# EasyEDA schematic 1-Schematic_EMWAVER_DIY_V2.json
TITLE: Sheet_1; REV: 1.0; Date: 2025-06-19; Sheet: 1/1; Drawn By: maarnotto; Company: Your Company
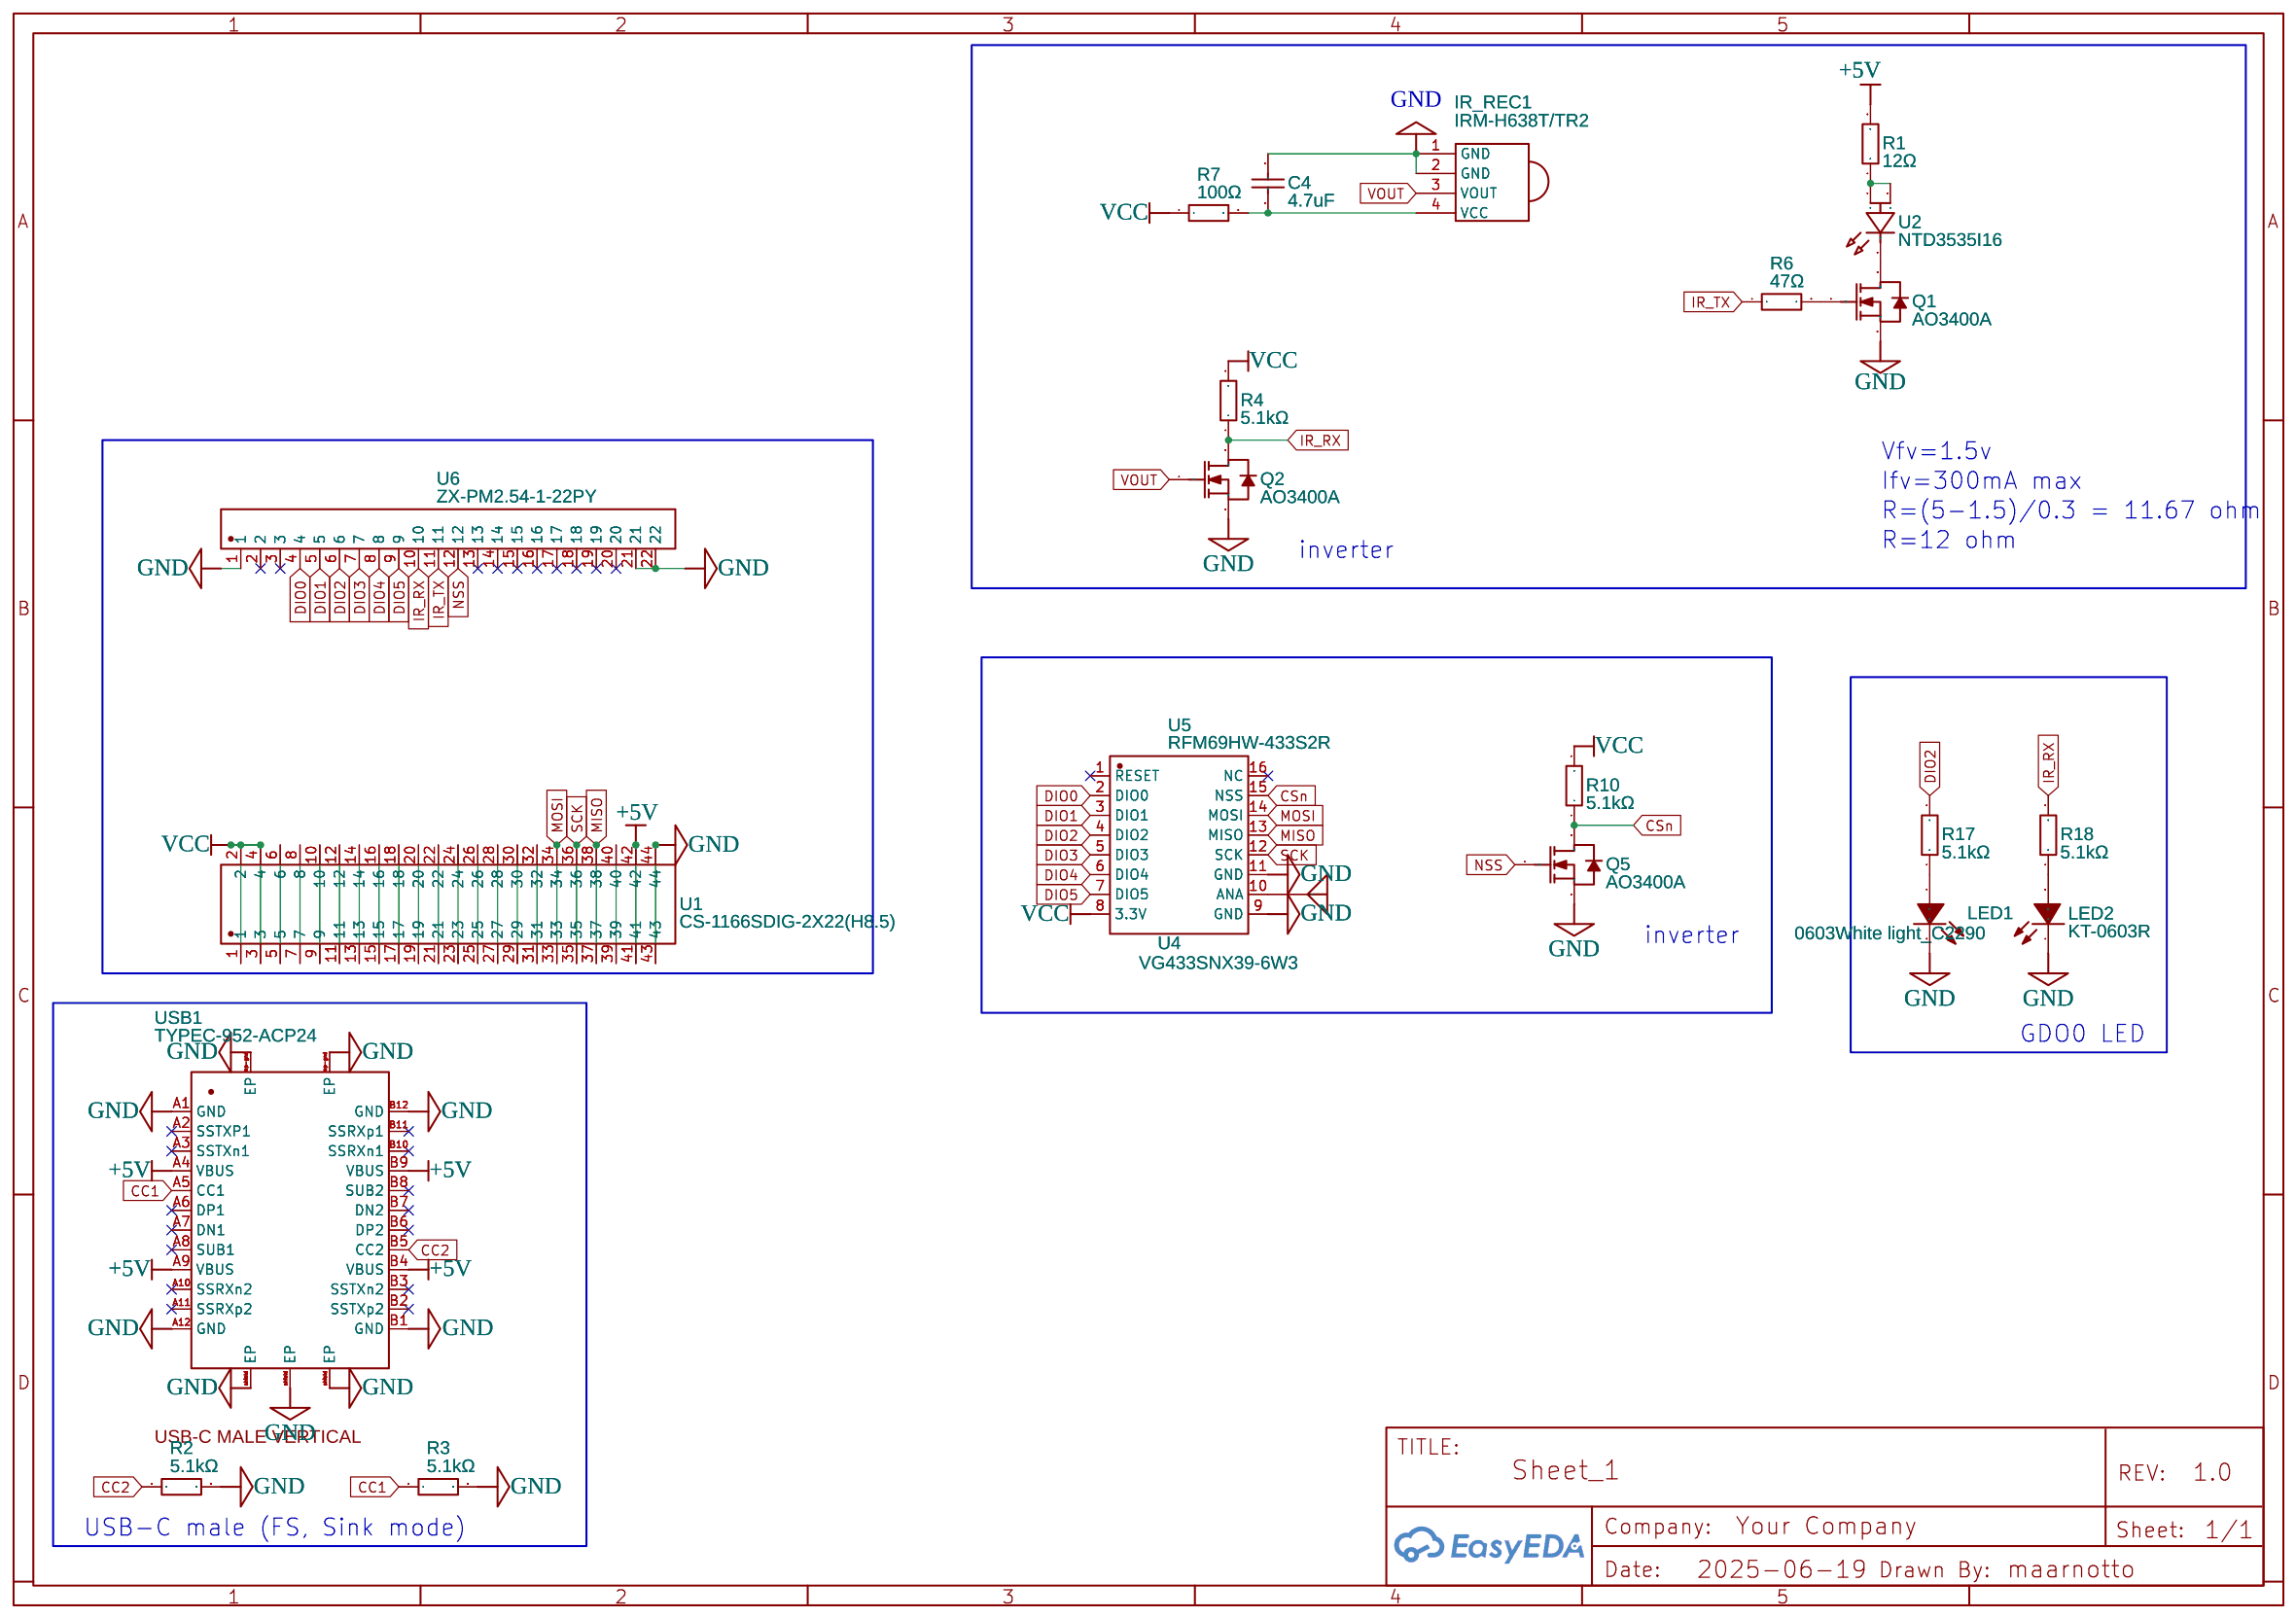
[diagram p0: schematic sheet]

## Parts
C4  4.7uF  [C0603]
IR_REC1  IRM-H638T/TR2  [SENSOR-SMD_IRM-H638T-TR2-TL]
LED1  0603White light_C2290  [LED0603-R-RD_WHITE]
LED2  KT-0603R  [LED0603-RD]
Q1  AO3400A  [SOT-23-3_L2.9-W1.6-P1.90-LS2.8-BR]
Q2  AO3400A  [SOT-23-3_L2.9-W1.6-P1.90-LS2.8-BR]
Q5  AO3400A  [SOT-23-3_L2.9-W1.6-P1.90-LS2.8-BR]
R1  12Ω  [R2512]
R2  5.1kΩ  [R0603]
R3  5.1kΩ  [R0603]
R4  5.1kΩ  [R0603]
R6  47Ω  [R0805]
R7  100Ω  [R0805]
R10  5.1kΩ  [R0603]
R17  5.1kΩ  [R0603]
R18  5.1kΩ  [R0603]
U1  CS-1166SDIG-2X22(H8.5)  [HDR-TH_44P-2.54-V-F-R2-C22-S2.54]
U2  NTD3535I16  [LED-SMD_3P-L3.5-W3.5-NTD3535I16]
U4  VG433SNX39-6W3  [ANT-TH_T14-433M]
U5  RFM69HW-433S2R  [WIRELM-SMD_RFM69HW-433S2R]
U6  ZX-PM2.54-1-22PY  [HDR-TH_22P-P2.54-V-F]
USB1  TYPEC-952-ACP24  [USB-C MALE VERTICAL]

## Library data of the parts
C4 = CL10A475KO8NNNC: Supplier: LCSC; Manufacturer: SAMSUNG(三星); Supplier Part: C19666; JLCPCB Part Class: Basic Part
IR_REC1 = IRM-H638T/TR2: Supplier: LCSC; Manufacturer: EVERLIGHT(亿光); Supplier Part: C91447; JLCPCB Part Class: Extended Part
LED1 = 0603White light_C2290: Supplier: LCSC; Manufacturer: KENTO; Manufacturer Part: KT-0603W; Supplier Part: C2290; JLCPCB Part Class: Basic Part
LED2 = KT-0603R: Supplier: LCSC; Manufacturer: KENTO; Supplier Part: C2286; JLCPCB Part Class: Basic Part
Q1 Q2 Q5 = AO3400A: Supplier: LCSC; Manufacturer: AOS; Supplier Part: C20917; JLCPCB Part Class: Basic Part
R1 = 25121WJ0120T4E: Supplier: LCSC; Manufacturer: UNI-ROYAL(厚声); Supplier Part: C32443; JLCPCB Part Class: Extended Part
R2-R4 R10 R17 R18 = 0603WAF5101T5E: Supplier: LCSC; Manufacturer: UNI-ROYAL(厚声); Supplier Part: C23186; JLCPCB Part Class: Basic Part
R6 = 0805W8F470JT5E: Supplier: LCSC; Manufacturer: UNI-ROYAL(厚声); Supplier Part: C17714; JLCPCB Part Class: Basic Part
R7 = 0805W8F1000T5E: Supplier: LCSC; Manufacturer: UNI-ROYAL(厚声); Supplier Part: C17408; JLCPCB Part Class: Basic Part
U1 = CS-1166SDIG-2X22(H8.5): Contributor: lcsc; Supplier: LCSC; Supplier Part: C2986996; Manufacturer: CST(永丰盈); JLCPCB Part Class: Extended Part
U2 = NTD3535I16: Supplier: LCSC; Supplier Part: C7464756; Manufacturer: 国星光电; Contributor: lcsc; JLCPCB Part Class: Extended Part
U4 = VG433SNX39-6W3: Contributor: lcsc; Supplier: LCSC; Supplier Part: C718844; Manufacturer: Vollgo(沃进); JLCPCB Part Class: Extended Part
U5 = RFM69HW-433S2R: Supplier: LCSC; Supplier Part: C22395813; Manufacturer: null; Contributor: lcsc; JLCPCB Part Class: Extended Part
U6 = ZX-PM2.54-1-22PY: Supplier: LCSC; Supplier Part: C7499337; Manufacturer: Megastar(兆星); Contributor: lcsc; JLCPCB Part Class: Extended Part
USB1 = TYPEC-952-ACP24: Contributor: LCSC; Supplier: LCSC; Supplier Part: C2840398; Manufacturer: XUNPU(讯普); JLCPCB Part Class: Extended Part; Package Display: Yes

## Nets
+5V: R1.2 U1.41 U1.42 USB1.A4(VBUS) USB1.A9(VBUS) USB1.B4(VBUS) USB1.B9(VBUS)
GND: C4.2 IR_REC1.1(GND) IR_REC1.2(GND) LED1.2(K) LED2.1(K) Q1.2(S) Q2.2(S) Q5.2(S) R2.2 R3.2 U1.43 U1.44 U5.9(GND) U5.11(GND) U6.1 U6.21 U6.22 USB1.A1(GND) USB1.A12(GND) USB1.B1(GND) USB1.B12(GND) USB1.mp-gnd(EP) USB1.shield(EP)
VCC: R4.2 R7.1 R10.2 U1.1 U1.2 U1.3 U1.4 U5.8(3.3V)
CC1: R3.1 USB1.A5(CC1)
CC2: R2.1 USB1.B5(CC2)
CSn: Q5.3(D) R10.1 U5.15(NSS)
DIO0: U5.2(DIO0) U6.4
DIO1: U5.3(DIO1) U6.5
DIO2: R17.2 U5.4(DIO2) U6.6
DIO3: U5.5(DIO3) U6.7
DIO4: U5.6(DIO4) U6.8
DIO5: U5.7(DIO5) U6.9
IR_RX: Q2.3(D) R4.1 R18.2 U6.10
IR_TX: R6.1 U6.11
MISO: U1.37 U1.38 U5.13(MISO)
MOSI: U1.33 U1.34 U5.14(MOSI)
NSS: Q5.1(G) U6.12
SCK: U1.35 U1.36 U5.12(SCK)
VOUT: IR_REC1.3(VOUT) Q2.1(G)
Net-(C4-1): C4.1 IR_REC1.4(VCC) R7.2
Net-(LED1-1): LED1.1(A) R17.1
Net-(LED2-2): LED2.2(A) R18.1
Net-(Q1-1): Q1.1(G) R6.2
Net-(Q1-3): Q1.3(D) U2.3(K)
Net-(R1-1): R1.1 U2.1(A) U2.2
Net-(U1-5): U1.5 U1.6
Net-(U1-7): U1.7 U1.8
Net-(U1-9): U1.9 U1.10
Net-(U1-11): U1.11 U1.12
Net-(U1-13): U1.13 U1.14
Net-(U1-15): U1.15 U1.16
Net-(U1-17): U1.17 U1.18
Net-(U1-19): U1.19 U1.20
Net-(U1-21): U1.21 U1.22
Net-(U1-23): U1.23 U1.24
Net-(U1-25): U1.25 U1.26
Net-(U1-27): U1.27 U1.28
Net-(U1-29): U1.29 U1.30
Net-(U1-31): U1.31 U1.32
Net-(U1-39): U1.39 U1.40
Net-(U4-1): U4.1 U5.10(ANA)

Not connected (* = marked no-connect by the designer): U5 1(RESET)* 16(NC)*; U6 2* 3* 13* 14* 15* 16* 17* 18* 19* 20*; USB1 A2(SSTXP1)* A3(SSTXn1)* A6(DP1)* A7(DN1)* A8(SUB1)* A10(SSRXn2)* A11(SSRXp2)* B2(SSTXp2)* B3(SSTXn2)* B6(DP2)* B7(DN2)* B8(SUB2)* B10(SSRXn1)* B11(SSRXp1)*

## Notes on the sheet
- Vfv=1.5v
- Ifv=300mA max
- R=(5-1.5)/0.3 = 11.67 ohm
- R=12 ohm
- inverter
- inverter
- GDO0 LED
- USB-C male (FS, Sink mode)
